# Altium schematic sheet top_blank.SchDoc
size 381 x 241 mm; SheetNumber: 1; SheetTotal: 9
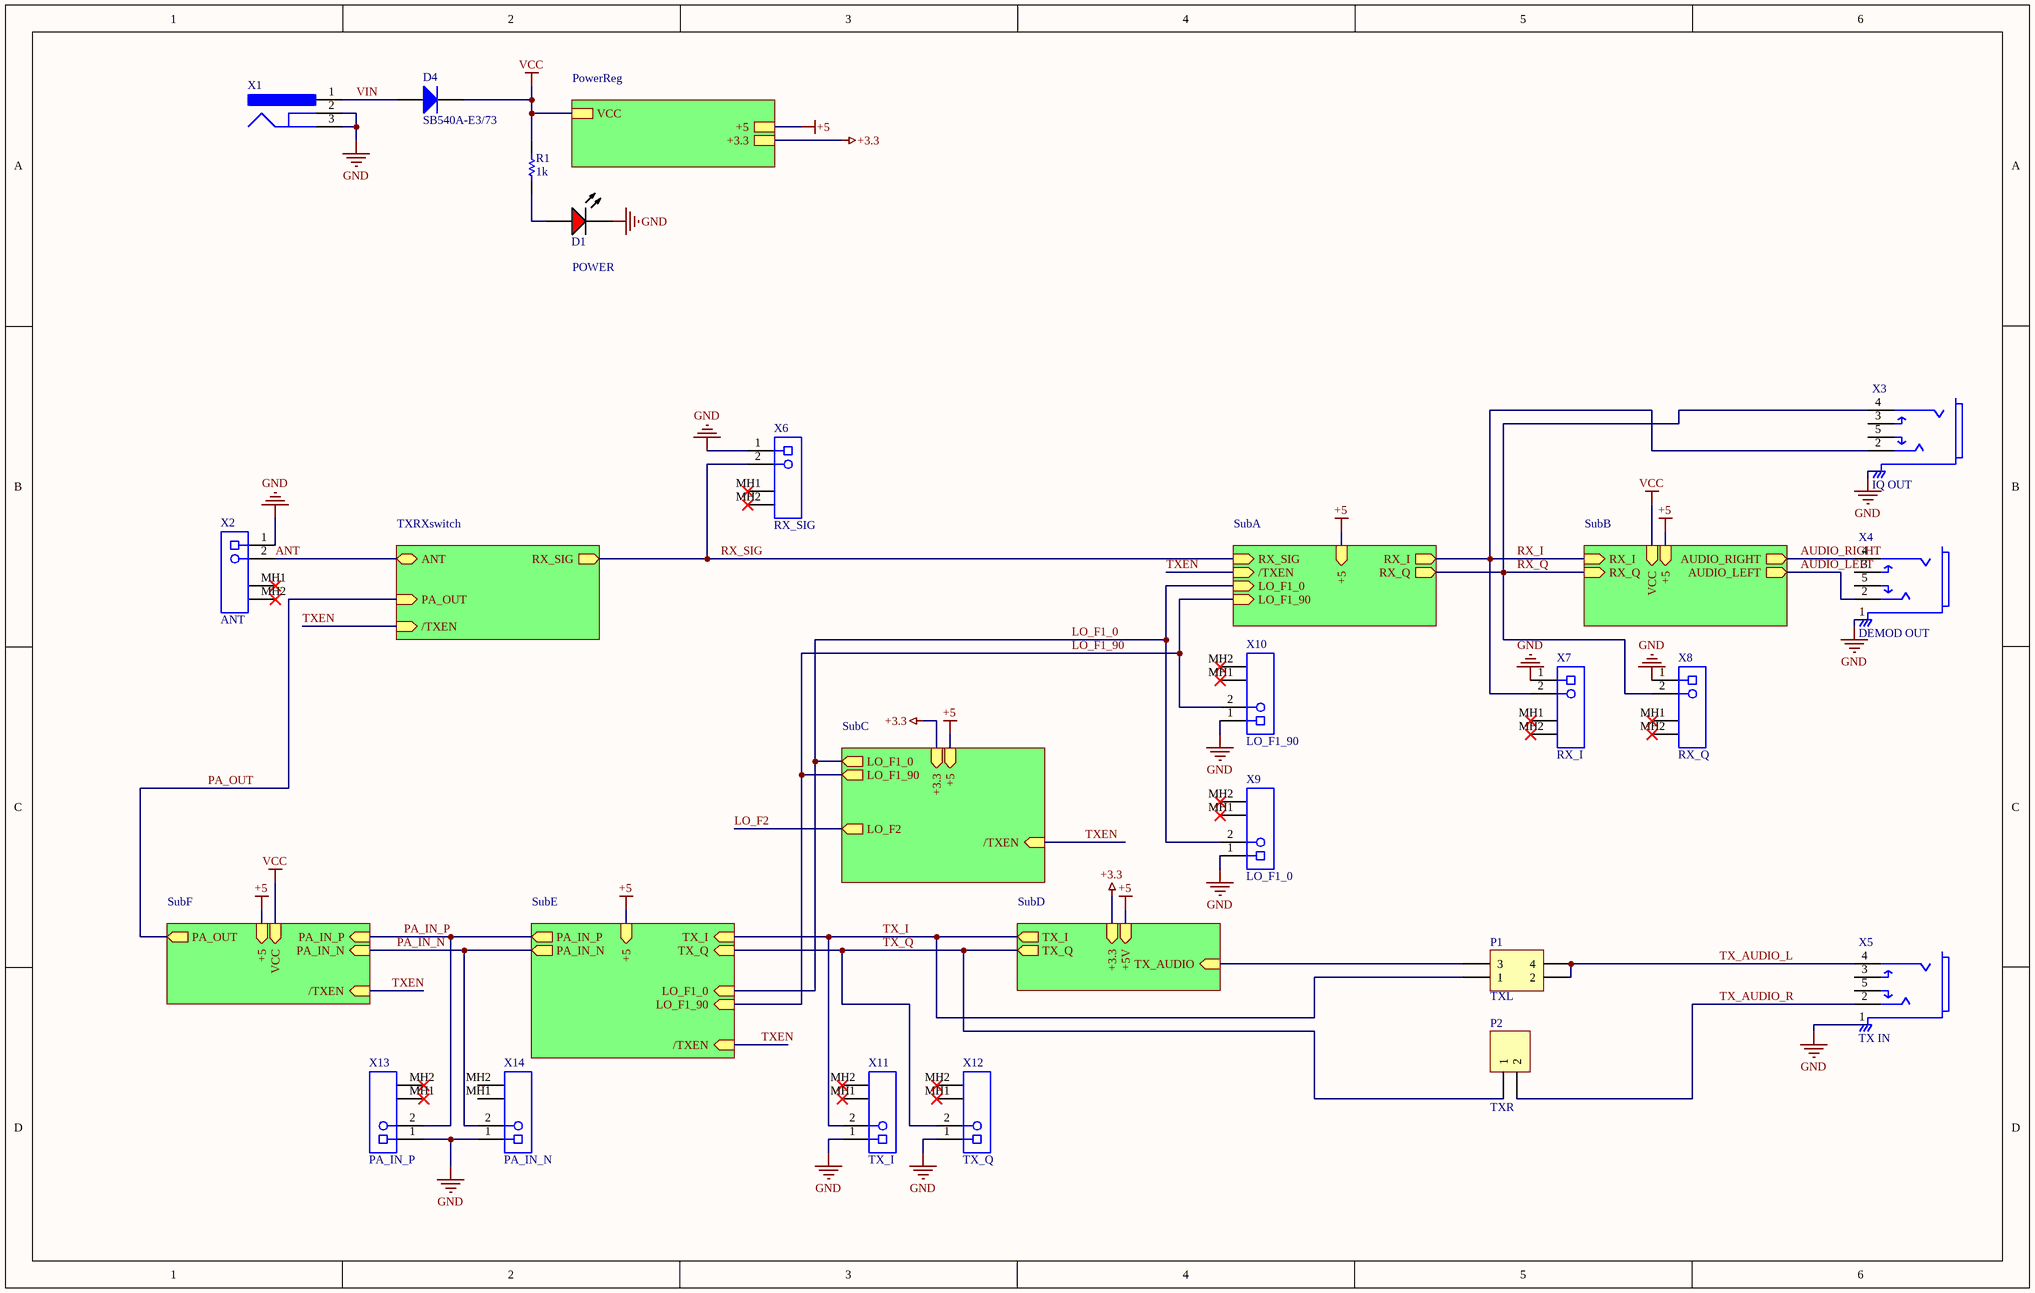
[diagram p0: top_blank.SchDoc]

## Parts
D1  POWER  [AVAG-HLMP-3301-2]
D4  SB540A-E3/73  [DO-201AD]
P1  TXL  [HDR2X2]
P2  TXR  [HDR1X2]
R1  value 1k  [AXIAL-0.4]  (hidden comment: Res1)
X1  PJ-002A  [CUI-PJ-002A_V]  (value not drawn)
X2  ANT  [TECO-1-1337543-0_V]
X3  IQ OUT  [FP-35RAPC4BV4-MFG]
X4  DEMOD OUT  [FP-35RAPC4BV4-MFG]
X5  TX IN  [FP-35RAPC4BV4-MFG]
X6  RX_SIG  [TECO-1-1337543-0_V]
X7  RX_I  [TECO-1-1337543-0_V]
X8  RX_Q  [TECO-1-1337543-0_V]
X9  LO_F1_0  [TECO-1-1337543-0_V]
X10  LO_F1_90  [TECO-1-1337543-0_V]
X11  TX_I  [TECO-1-1337543-0_V]
X12  TX_Q  [TECO-1-1337543-0_V]
X13  PA_IN_P  [TECO-1-1337543-0_V]
X14  PA_IN_N  [TECO-1-1337543-0_V]

## Sub-sheets
PowerReg = power_intg.SchDoc: VCC, +3.3, +5
SubA = rxall_blank.SchDoc: RX_SIG (in), /TXEN (in), LO_F1_0 (in), LO_F1_90 (in), RX_I (out), +5 (in), RX_Q (out)
SubB = demod_blank.SchDoc: AUDIO_LEFT (out), AUDIO_RIGHT (out), +5 (in), RX_Q (in), RX_I (in), VCC (in)
SubC = osc_blank.SchDoc: /TXEN (in), LO_F1_0 (out), LO_F1_90 (out), LO_F2 (out), +5 (in), +3.3 (in)
SubD = modulator.SchDoc: TX_AUDIO (in), TX_I (out), TX_Q (out), +3.3 (in), +5V (in)
SubE = qse_blank.SchDoc: TX_I (in), TX_Q (in), /TXEN (in), LO_F1_0 (in), LO_F1_90 (in), +5 (in), PA_IN_P (out), PA_IN_N (out)
SubF = pa_blank.SchDoc: PA_OUT (out), /TXEN (in), +5 (in), VCC (in), PA_IN_P (in), PA_IN_N (in)
TXRXswitch = switch_blank.SchDoc: ANT (bidir), RX_SIG (out), /TXEN (in), PA_OUT (in)

## Nets
+3.3: sheet SubC/+3.3, sheet PowerReg/+3.3, sheet SubD/+3.3
+5: sheet SubB/+5, sheet SubC/+5, sheet SubF/+5, sheet SubE/+5, sheet PowerReg/+5, sheet SubA/+5, sheet SubD/+5V
GND: D1.1(K) X1.2 X1.3 X2.1 X3.1 X4.1 X5.1 X6.1 X7.1 X8.1 X9.1 X10.1 X11.1 X12.1 X13.1 X14.1
VCC: D4.2(K) R1.2 ; sheet SubB/VCC, sheet SubF/VCC, sheet PowerReg/VCC
ANT: X2.2 ; sheet TXRXswitch/ANT
AUDIO_LEFT: X4.2 ; sheet SubB/AUDIO_LEFT
AUDIO_RIGHT: X4.4 ; sheet SubB/AUDIO_RIGHT
LO_F1_0: X9.2 ; sheet SubC/LO_F1_0, sheet SubE/LO_F1_0, sheet SubA/LO_F1_0
LO_F1_90: X10.2 ; sheet SubC/LO_F1_90, sheet SubE/LO_F1_90, sheet SubA/LO_F1_90
LO_F2: sheet SubC/LO_F2
PA_IN_N: X14.2 ; sheet SubF/PA_IN_N, sheet SubE/PA_IN_N
PA_IN_P: X13.2 ; sheet SubF/PA_IN_P, sheet SubE/PA_IN_P
PA_OUT: sheet SubF/PA_OUT, sheet TXRXswitch/PA_OUT
RX_I: X3.2 X7.2 ; sheet SubB/RX_I, sheet SubA/RX_I
RX_Q: X3.4 X8.2 ; sheet SubB/RX_Q, sheet SubA/RX_Q
RX_SIG: X6.2 ; sheet SubA/RX_SIG, sheet TXRXswitch/RX_SIG
TX_AUDIO_L: P1.2 P1.4 X5.4
TX_AUDIO_R: P2.2 X5.2
TX_I: P1.1 X11.2 ; sheet SubE/TX_I, sheet SubD/TX_I
TX_Q: P2.1 X12.2 ; sheet SubE/TX_Q, sheet SubD/TX_Q
TXEN: sheet SubC//TXEN, sheet SubF//TXEN, sheet SubE//TXEN, sheet SubA//TXEN, sheet TXRXswitch//TXEN
VIN: D4.1(A) X1.1
NetD1_2: D1.2(A) R1.1
NetP1_3: P1.3 ; sheet SubD/TX_AUDIO

Not connected (* = marked no-connect by the designer): X2 MH1* MH2*; X3 3 5; X4 3 5; X5 3 5; X6 MH1* MH2*; X7 MH1* MH2*; X8 MH1* MH2*; X9 MH1* MH2*; X10 MH1* MH2*; X11 MH1* MH2*; X12 MH1* MH2*; X13 MH1* MH2*; X14 MH1 MH2

## Library data of the parts
D1 = CMP-2000-06411-1: T-1 3/4 (5 mm) Diffused LED Lamp, 1.9 V, -40 to 100 degC, 2-Pin THD, RoHS, Bulk; Manufacturer: Avago; Forward Current: 25mA; Forward Voltage: 2.4V; Peak Wavelength: 635nm; Shape Type: Circular; High Brightness: No; Main Category: StandardLED; Test Current (It): 10mA; Dominant Wave Length: 626nm; Number of  Elements: 1; Reverse Voltage: 5V; Chip Material: GaP; Product Height (mm): 9.19mm; Lens Type: ColoredDiffused; Viewing Angle: 60deg; Type: Uni-Color; Emitting Color: Red; Luminous Intensity: 5.4mcd; Power Dissipation: 85W; DELETED: Compliant; Product Depth (mm): 6.1mm; Package Description: 2-Pin Through Hole LED, Dia 5.85 mm; Mounting Technology: ThroughHole; Manufacturer URL: http://www.avagotech.com/; Package Type: T-13/4; Operating Temp Range: -40Cto100C; Datasheet URL: http://www.avagotech.com/docs/AV02-1558EN; Mounting: ThroughHole; Lens Dimensions: 5.08x5.08x8.3mm; Package Reference: HLMP-3301; Datasheet Version: 03/2015; Pin Count: 2; Packaging: TapeandReel; Operating Temperature Classification: Industrial; Lum Intensity: 5.4mcd; Rad Hardened: No; Product Length (mm): 6.1mm
D4 = Diode 1N5408: 3 Amp Medium Power Silicon Rectifier Diode; Published: 8-Jun-2000; LatestRevisionDate: 17-Jul-2002; LatestRevisionNote: Re-released for DXP Platform.; DatasheetVersion: Aug-1984; PackageReference: DO-201AD; Publisher: Altium Limited; PackageDescription: Diode, Axial; Body 9.5 x 5.3 mm (LxDia. max), Lead Dia. 1.32 mm (max); ComponentLink1Description: Manufacturer Link; ComponentLink1URL: http://www.irf.com/
P1 = Header 2X2: Header, 2-Pin, Dual row; LatestRevisionDate: 17-Jul-2002; LatestRevisionNote: Re-released for DXP Platform.; Publisher: Altium Limited
P2 = Header 2: Header, 2-Pin; LatestRevisionDate: 17-Jul-2002; LatestRevisionNote: Re-released for DXP Platform.; Publisher: Altium Limited
R1 = Res1: Resistor; Published: 8-Jun-2000; LatestRevisionDate: 17-Jul-2002; LatestRevisionNote: Re-released for DXP Platform.; PackageReference: AXIAL-0.3; Publisher: Altium Limited; PackageDescription: Axial Device, Thru-Hole; 2 Leads; 0.3 in Pin Spacing
X1 = CMP-2000-06895-1: Through Hole Right Angle DC Power Jack, 2.5 A, 2 mm Center Pin, 3 Position, -25 to 85 degC, RoHS, Bulk; Manufacturer: CUIInc.; Current Rating: 2.5A; Inside Contact Diameter: 2mm; Insulation Resistance: 50MOhms; Outside Contact Diameter: 6.5mm; Voltage Rating: 24V; Brand: CUI; Operating Temperature Range: -25Cto+85C; Mounting Technology: ThroughHole; Connector Type: DCPowerJack; Contact Material: Copper; Datasheet URL: http://www.cui.com/product/resource/pj-002a.pdf; Contact Gender: Male; Housing Material: PolybutyleneTerephthalate(PBT); Manufacturer URL: http://www.cui.com/; Package Reference: PJ-002A; Mounting Style: ThroughHole; Mounting Angle: Right; Product Category: DCPowerConnectors; Product: Jacks; Flammability Rating: UL94V-0; Contact Plating: Nickel; RoHS: True; Datasheet Version: Rev. 1.03, 04/2016; Package Description: 3-Pin Through Hole Device, Body 14.4 x 9 mm, Height 11 mm; Factory Pack Quantity: 500; Termination Style: ThroughHole
X2 X6-X14 = CMP-2000-05853-1: Female Connector, Pitch 2.54 mm, 1 x 2 Position, Height 15.8 mm, Tail Length 3.8 mm, / -55 to 85 degC, RoHS, Bulk; Manufacturer: TE Connectivity; Connector Body Style: RightAngleJack; Frequency Max: 4GHz; Coaxial Termination: Solder; Connector Mounting: PCBMount; SVHC: ToBeAdvised; Connector Type: BNCCoaxial; Impedance: 50ohm; Coaxial Cable Types: -; Manufacturer URL: http://www.te.com/; Package Reference: 1-1337543-0; Product Range: -; Datasheet URL: http://www.te.com/commerce/DocumentDelivery/DDEController?Action=showdoc&DocId=Customer+Drawing%7F1337543%7FG%7Fpdf%7FEnglish%7FENG_CD_1337543_G.pdf%7F1-1337543-0; Contact Plating: GoldPlatedContacts; Mounting Technology: ThroughHole; Package Description: Female Connector, Pitch 2.54 mm, 1 x 2 Position, Height 15.8 mm, Tail Length 3.8 mm; Contact Material: Brass; Datasheet Version: Rev. G, 12/2012
X3-X5 = CMP-47983-000001-1: CONN JACK STEREO 3.5MM R/A; Manufacturer: Switchcraft; Obsolete Part: true; Manufacturer Part Number: 35RAPC4BV4; Conn Orientation: Right Angle; Number Of Contacts: 5; Contact Material: Silver; Device Class L1: Connectors; Height: 0.495inch; ComponentLink2URL: http://www.switchcraft.com/Drawings/35rapc__v4_cd.pdf; Category: Conn; Digikey Description: CONN JACK STEREO 3.5MM R/A; Automotive: No; ComponentLink2Description: Datasheet; Package: 35RAPC4BV4; Device Class L2: Audio / Video Connectors; Mouser Description: Phone Connectors 3.5MM VERT STEREO JK; RoHS: TRUE; Octopart: https://octopart.com/35rapc4bv4-switchcraft-223606; Lead Free: Yes; Device Class L3: unset